# Altium schematic sheet Sitara_AUX.SchDoc
size A3; SheetNumber: 5; SheetTotal: 10
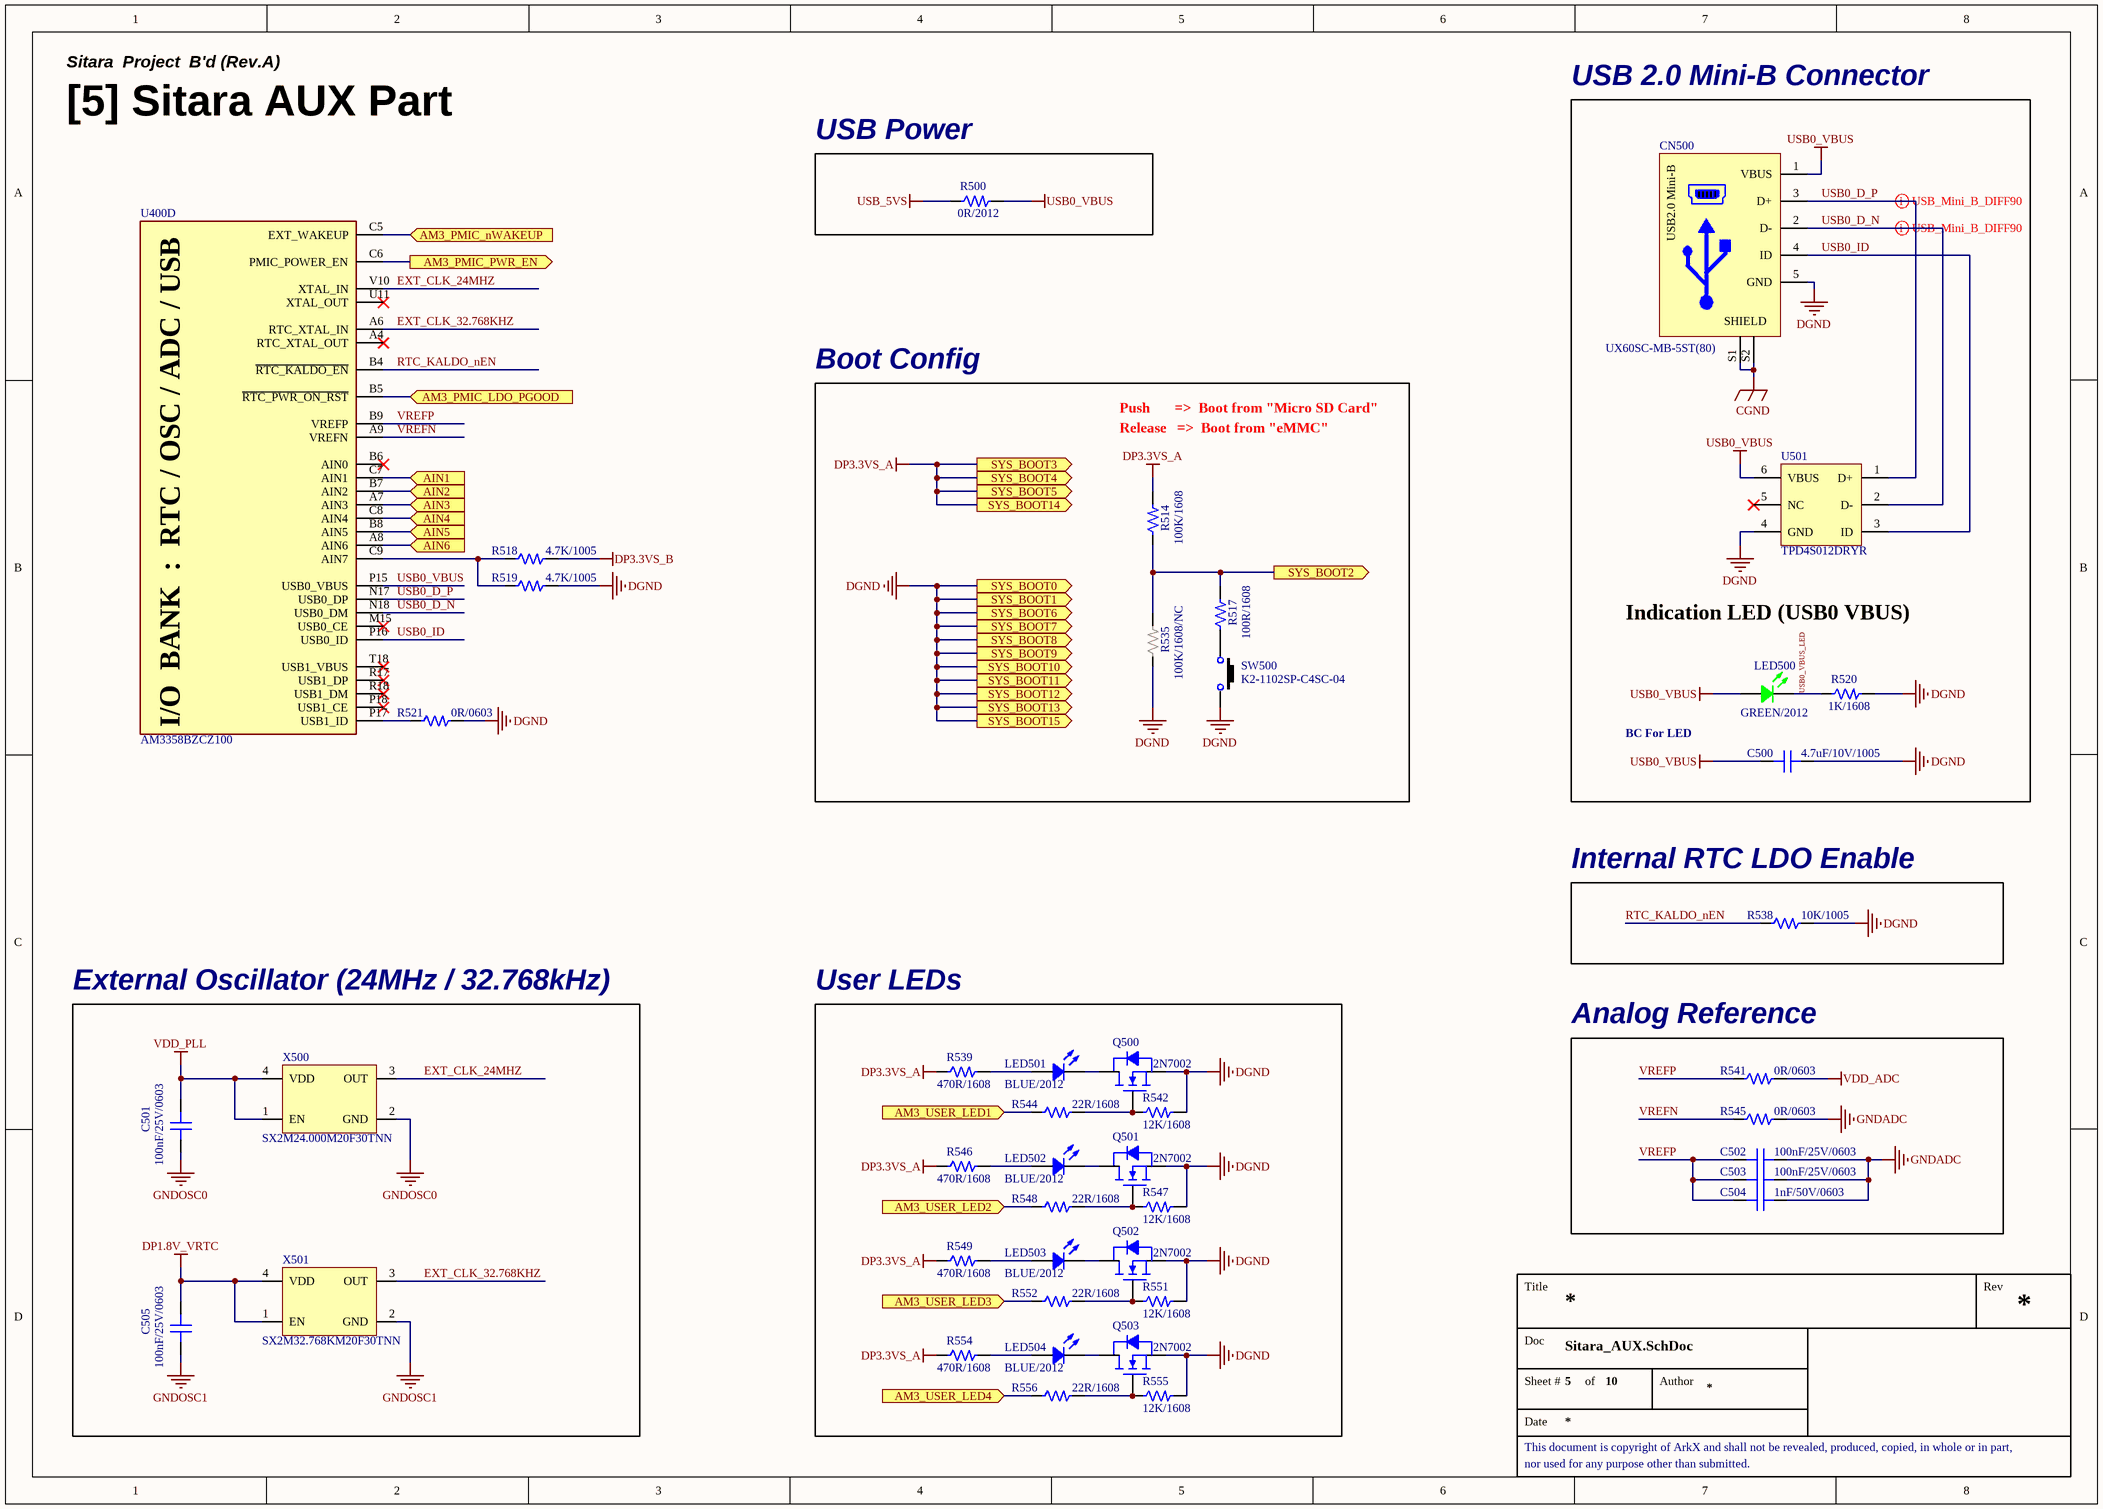
[diagram p0: Sitara_AUX.SchDoc]

## Parts
C500  4.7uF/10V/1005  [CAP 1005 (0402_INCH)]
C501  100nF/25V/0603  [CAP 0603 (0201_INCH)]
C502  100nF/25V/0603  [CAP 0603 (0201_INCH)]
C503  100nF/25V/0603  [CAP 0603 (0201_INCH)]
C504  1nF/50V/0603  [CAP 0603 (0201_INCH)]
C505  100nF/25V/0603  [CAP 0603 (0201_INCH)]
CN500  UX60SC-MB-5ST(80)  [CON_USB2.0-Mini-B (UX60SC-MB-5ST(80))]
LED500  GREEN/2012  [LED MHT170RGBCT (GREEN)]
LED501  BLUE/2012  [LED MHT170RGBCT (BLUE)]
LED502  BLUE/2012  [LED MHT170RGBCT (BLUE)]
LED503  BLUE/2012  [LED MHT170RGBCT (BLUE)]
LED504  BLUE/2012  [LED MHT170RGBCT (BLUE)]
Q500  2N7002  [SOT 23-3 (DIODES INCORPORATED)]
Q501  2N7002  [SOT 23-3 (DIODES INCORPORATED)]
Q502  2N7002  [SOT 23-3 (DIODES INCORPORATED)]
Q503  2N7002  [SOT 23-3 (DIODES INCORPORATED)]
R500  0R/2012  [RES 2012 (0805_inch)]
R514  100K/1608  [RES 1608 (0603_inch)]
R517  100R/1608  [RES 1608 (0603_inch)]
R518  4.7K/1005  [RES 1005 (0402_inch)]
R519  4.7K/1005  [RES 1005 (0402_inch)]
R520  1K/1608  [RES 1608 (0603_inch)]
R521  0R/0603  [RES 0603 (0201_inch)]
R535  100K/1608/NC  [RES 1608 (0603_inch)/NC]
R538  10K/1005  [RES 1005 (0402_inch)]
R539  470R/1608  [RES 1608 (0603_inch)]
R541  0R/0603  [RES 0603 (0201_inch)]
R542  12K/1608  [RES 1608 (0603_inch)]
R544  22R/1608  [RES 1608 (0603_inch)]
R545  0R/0603  [RES 0603 (0201_inch)]
R546  470R/1608  [RES 1608 (0603_inch)]
R547  12K/1608  [RES 1608 (0603_inch)]
R548  22R/1608  [RES 1608 (0603_inch)]
R549  470R/1608  [RES 1608 (0603_inch)]
R551  12K/1608  [RES 1608 (0603_inch)]
R552  22R/1608  [RES 1608 (0603_inch)]
R554  470R/1608  [RES 1608 (0603_inch)]
R555  12K/1608  [RES 1608 (0603_inch)]
R556  22R/1608  [RES 1608 (0603_inch)]
SW500  K2-1102SP-C4SC-04  [SW K2-1102SP-C4SC-04]
U400  AM3358BZCZ100  [IC_SOC_AM3358BZCZ100]  (part D of 8)
U501  TPD4S012DRYR  [IC_SON-6]
X500  SX2M24.000M20F30TNN  [OSC SMD_2.5x2.0 (SCTF)]
X501  SX2M32.768KM20F30TNN  [OSC SMD_2.5x2.0 (SCTF)]

## Blocks framed on the sheet
USB 2.0 Mini-B Connector: C500 CN500 LED500 R520 U501
USB Power: R500
Boot Config: R514 R517 R535 SW500
Internal RTC LDO Enable: R538
External Oscillator (24MHz / 32.768kHz): C501 C505 X500 X501
User LEDs: LED501-LED504 Q500-Q503 R539 R542 R544 R546-R549 R551 R552 R554-R556
Analog Reference: C502-C504 R541 R545

## Ports
AIN1 (in, see Sitara_Connectors[4A]), AIN2 (in, see Sitara_Connectors[3B]), AIN3 (in, see Sitara_Connectors[3B]), AIN4 (in, see Sitara_Connectors[4A]), AIN5 (in, see Sitara_Connectors[4A]), AIN6 (in, see Sitara_Connectors[4A]), AM3_PMIC_LDO_PGOOD (in, see Power[3C]), AM3_PMIC_nWAKEUP (in, see Power[3C]), AM3_PMIC_PWR_EN (out, see Power[3C]), AM3_USER_LED1 (in, see Sitara_Connectors[3C], Sitara_IO_Bank_123[2A]), AM3_USER_LED2 (in, see Sitara_Connectors[3C], Sitara_IO_Bank_123[2A]), AM3_USER_LED3 (in, see Sitara_Connectors[3C], Sitara_IO_Bank_123[2A]), AM3_USER_LED4 (in, see Sitara_Connectors[3C], Sitara_IO_Bank_123[2A]), SYS_BOOT0 (out, see Sitara_Connectors[3A], Sitara_IO_Bank_6[2B]), SYS_BOOT1 (out, see Sitara_Connectors[3A], Sitara_IO_Bank_6[2B]), SYS_BOOT2 (out, see Sitara_Connectors[3A], Sitara_IO_Bank_6[2B]), SYS_BOOT3 (out, see Sitara_Connectors[3A], Sitara_IO_Bank_6[2B]), SYS_BOOT4 (out, see Sitara_Connectors[3A], Sitara_IO_Bank_6[2B]), SYS_BOOT5 (out, see Sitara_Connectors[2C], Sitara_IO_Bank_6[2B]), SYS_BOOT6 (out, see Sitara_Connectors[2C], Sitara_IO_Bank_6[2B]), SYS_BOOT7 (out, see Sitara_Connectors[2C], Sitara_IO_Bank_6[2B]), SYS_BOOT8 (out, see Sitara_Connectors[2C], Sitara_IO_Bank_6[2B]), SYS_BOOT9 (out, see Sitara_Connectors[2C], Sitara_IO_Bank_6[2B]), SYS_BOOT10 (out, see Sitara_Connectors[2D], Sitara_IO_Bank_6[2B]), SYS_BOOT11 (out, see Sitara_Connectors[4A], Sitara_IO_Bank_6[2B]), SYS_BOOT12 (out, see Sitara_Connectors[4A], Sitara_IO_Bank_6[2B]), SYS_BOOT13 (out, see Sitara_Connectors[3B], Sitara_IO_Bank_6[2B]), SYS_BOOT14 (out, see Sitara_Connectors[3B], Sitara_IO_Bank_6[2C]), SYS_BOOT15 (out, see Sitara_Connectors[3B], Sitara_IO_Bank_6[2C])

## Nets
CGND: CN500.S1(SHIELD) CN500.S2(SHIELD)
DGND: C500.2 CN500.5(GND) Q500.2(S) Q501.2(S) Q502.2(S) Q503.2(S) R519.2 R520.2 R521.2 R535.1 R538.2 R542.2 R547.2 R551.2 R555.2 SW500.3 U501.4(GND) ; port SYS_BOOT0, port SYS_BOOT15, port SYS_BOOT1, port SYS_BOOT6, port SYS_BOOT7, port SYS_BOOT8, port SYS_BOOT9, port SYS_BOOT10, port SYS_BOOT11, port SYS_BOOT12, port SYS_BOOT13
DP1.8V_VRTC: C505.2 X501.1(EN) X501.4(VDD)
DP3.3VS_A: R514.2 R539.1 R546.1 R549.1 R554.1 ; port SYS_BOOT3, port SYS_BOOT4, port SYS_BOOT5, port SYS_BOOT14
DP3.3VS_B: R518.2
GNDADC: C502.2 C503.2 C504.2 R545.2
GNDOSC0: C501.1 X500.2(GND)
GNDOSC1: C505.1 X501.2(GND)
USB0_VBUS: C500.1 CN500.1(VBUS) LED500.4(Common_Anode) R500.2 U400.P15(USB0_VBUS) U501.6(VBUS)
USB_5VS: R500.1
VDD_ADC: R541.2
VDD_PLL: C501.2 X500.1(EN) X500.4(VDD)
AIN1: U400.C7(AIN1) ; port AIN1
AIN2: U400.B7(AIN2) ; port AIN2
AIN3: U400.A7(AIN3) ; port AIN3
AIN4: U400.C8(AIN4) ; port AIN4
AIN5: U400.B8(AIN5) ; port AIN5
AIN6: U400.A8(AIN6) ; port AIN6
AM3_PMIC_LDO_PGOOD: U400.B5(~{RTC_PWR_ON_RST}) ; port AM3_PMIC_LDO_PGOOD
AM3_PMIC_nWAKEUP: U400.C5(EXT_WAKEUP) ; port AM3_PMIC_nWAKEUP
AM3_PMIC_PWR_EN: U400.C6(PMIC_POWER_EN) ; port AM3_PMIC_PWR_EN
AM3_USER_LED1: R544.1 ; port AM3_USER_LED1
AM3_USER_LED2: R548.1 ; port AM3_USER_LED2
AM3_USER_LED3: R552.1 ; port AM3_USER_LED3
AM3_USER_LED4: R556.1 ; port AM3_USER_LED4
EXT_CLK_24MHZ: U400.V10(XTAL_IN) X500.3(OUT)
EXT_CLK_32.768KHZ: U400.A6(RTC_XTAL_IN) X501.3(OUT)
RTC_KALDO_nEN: R538.1 U400.B4(~{RTC_KALDO_EN})
SYS_BOOT2: R514.1 R517.2 R535.2 ; port SYS_BOOT2
USB0_D_N: CN500.2(D-) U400.N18(USB0_DM) U501.2(D-)
USB0_D_P: CN500.3(D+) U400.N17(USB0_DP) U501.1(D+)
USB0_ID: CN500.4(ID) U400.P16(USB0_ID) U501.3(ID)
USB0_VBUS_LED: LED500.2(GREEN) R520.1
VREFN: R545.1 U400.A9(VREFN)
VREFP: C502.1 C503.1 C504.1 R541.1 U400.B9(VREFP)
NetLED501_3: LED501.3(BLUE) Q500.3(D)
NetLED501_4: LED501.4(Common_Anode) R539.2
NetLED502_3: LED502.3(BLUE) Q501.3(D)
NetLED502_4: LED502.4(Common_Anode) R546.2
NetLED503_3: LED503.3(BLUE) Q502.3(D)
NetLED503_4: LED503.4(Common_Anode) R549.2
NetLED504_3: LED504.3(BLUE) Q503.3(D)
NetLED504_4: LED504.4(Common_Anode) R554.2
NetQ500_1: Q500.1(G) R542.1 R544.2
NetQ501_1: Q501.1(G) R547.1 R548.2
NetQ502_1: Q502.1(G) R551.1 R552.2
NetQ503_1: Q503.1(G) R555.1 R556.2
NetR517_1: R517.1 SW500.1
NetR518_1: R518.1 R519.1 U400.C9(AIN7)
NetR521_1: R521.1 U400.P17(USB1_ID)

Not connected (* = marked no-connect by the designer): U400 A4(RTC_XTAL_OUT)* B6(AIN0)* M15(USB0_CE)* P18(USB1_CE)* R17(USB1_DP)* R18(USB1_DM)* T18(USB1_VBUS)* U11(XTAL_OUT)*; U501 5(NC)*

## Layout directives
differential pair; differential pair class USB_Mini_B_DIFF90: USB0_D_N, USB0_D_P

## Notes on the sheet
- Sitara  Project  B'd (Rev.A)
- [5] Sitara AUX Part
- Push       =>  Boot from "Micro SD Card"
- Release   =>  Boot from "eMMC"
- Indication LED (USB0 VBUS)
- BC For LED
- Title
- Rev
- Doc
- Sheet #
- of
- Author
- This document is copyright of ArkX and shall not be revealed, produced, copied, in whole or in part,
- Date
- nor used for any purpose other than submitted.
- (in symbol CON_USB2.0-Mini-B) USB2.0 Mini-B
- (in symbol IC_SOC_AM3358BZCZ100, part D) I/O  BANK  :  RTC / OSC / ADC / USB

## Library data of the parts
C500 = CAP_4.7uF/10V/1005: 10V 4.7uF X5R ±20% 0402  Multilayer Ceramic Capacitors MLCC - SMD/SMT ROHS; JLCPCB Part Type: Basic Part; LCSC Part #: C23733
C501-C503 C505 = CAP_100nF/25V/0603: Ceramic CAP_100nF/25V/0603; JLCPCB Part Type: Extended Part; LCSC Part #: C181047
C504 = CAP_1nF/50V/0603: Ceramic CAP_1nF/50V/0603; JLCPCB Part Type: Extended Part; LCSC Part #: C85934
CN500 = CON_USB2.0-Mini-B: USB - mini B USB 2.0 Receptacle Connector 5 Position Surface Mount, Right Angle; LCSC Part #: C2692070; JLCPCB Part Type: Extended Part
LED500 = LED_MHT170RGBCT(GREEN): Colorless transparence -30℃~+85℃ Positive post Common anode RGB 120° 0805  Light Emitting Diodes (LED) ROHS; LCSC Part #: C2962094; JLCPCB Part Type: Extended Part
LED501-LED504 = LED_MHT170RGBCT(BLUE): Colorless transparence -30℃~+85℃ Positive post Common anode RGB 120° 0805  Light Emitting Diodes (LED) ROHS; LCSC Part #: C2962094; JLCPCB Part Type: Extended Part
Q500-Q503 = FET_2N7002: 60V 115mA 200mW 7.5Ω@10V,500mA N Channel SOT-23  MOSFETs ROHS; LCSC Part #: C8545; JLCPCB Part Type: Basic Part
R500 = RES_0R/2012/0.125W: Value: 0R; Power Rating: 0.125W; Precision: 1%; Size: 2012; LCSC Part #: C17477; JLCPCB Part Type: Basic Part
R514 = RES_100K/1608/0.1W: Value: 100K; Power Rating: 0.1W; Precision: 1%; Size: 1608; LCSC Part #: C25803; JLCPCB Part Type: Basic Part
R517 = RES_100R/1608/0.1W: Value: 100R; Power Rating: 0.1W; Precision: 1%; Size: 1608; LCSC Part #: C22775; JLCPCB Part Type: Basic Part
R518 R519 = RES_4.7K/1005/62.5mW: Value: 4.7K; Power Rating: 62.5mW; Precision: 1%; Size: 1005; LCSC Part #: C25900; JLCPCB Part Type: Basic Part
R520 = RES_1K/1608/0.1W: Value: 1K; Power Rating: 0.1W; Precision: 1%; Size: 1608; LCSC Part #: C21190; JLCPCB Part Type: Basic Part
R521 R541 R545 = RES_0R/0603/50mW: 50mW Thick Film Resistors 25V ±1% 0Ω 0201  Chip Resistor - Surface Mount ROHS; Value: 0R; Size: 0603; Power Rating: 50mW; Precision: 1%; LCSC Part #: C106227; JLCPCB Part Type: Extended Part
R535 = RES_NC_100K/1608/0.1W: RES_100K/1608/0.1W; Value: 100K; Power Rating: 0.1W; Precision: 1%; Size: 1608
R538 = RES_10K/1005/62.5mW: Value: 10K; Power Rating: 62.5mW; Precision: 1%; Size: 1005; LCSC Part #: C25744; JLCPCB Part Type: Basic Part
R539 R546 R549 R554 = RES_470R/1608/0.1W: Value: 470R; Power Rating: 0.1W; Precision: 1%; Size: 1608; LCSC Part #: C23179; JLCPCB Part Type: Basic Part
R542 R547 R551 R555 = RES_12K/1608/0.1W: Value: 12K; Power Rating: 0.1W; Precision: 1%; Size: 1608; LCSC Part #: C22790; JLCPCB Part Type: Basic Part
R544 R548 R552 R556 = RES_22R/1608/0.1W: Value: 22R; Power Rating: 0.1W; Precision: 1%; Size: 1608; LCSC Part #: C23345; JLCPCB Part Type: Basic Part
SW500 = SW_K2-1102SP-C4SC-04(2P): -25℃~+85℃ 6mm 5mm Round Button 50mA Brick nogging 6mm SPST 100MΩ 100000 250gf@±30gf 12V SMD  Tactile Switches ROHS; LCSC Part #: C127509; JLCPCB Part Type: Extended Part
U400 = IC_SOC_AM3358BZCZ100: ARM® Cortex®-A8 Microprocessor IC Sitara™ 1 Core, 32-Bit 1.0GHz 324-NFBGA (15x15); LCSC Part #: C73932; JLCPCB Part Type: Extended Part
U501 = DIO_TVS_TPD4S012DRYR: Clamp 3A (8/20µs) Ipp Tvs Diode Surface Mount 6-SON (1.45x1); LCSC Part #: C96506; JLCPCB Part Type: Extended Part
X500 = OSC_SX2M24.000M20F30TNN(24MHz): 1.62V~3.63V ±20ppm 10mA ±30ppm CMOS 24MHz SMD2520-4P  Crystal Oscillators ROHS; LCSC Part #: C2901600; JLCPCB Part Type: Extended Part
X501 = OSC_SX2M32.768KM20F30TNN(32.768kHz): 1.62V~3.63V ±20ppm 90uA ±30ppm CMOS 32.768kHz SMD2520-4P  Crystal Oscillators ROHS; LCSC Part #: C2901603; JLCPCB Part Type: Extended Part